# Altium schematic sheet adc_dac_main.SchDoc: mcHF Pro Transceiver UI board
size A3; Author: Krassi Atanassov; CompanyName: MØNKA; Engineer: For radio amateurs experimentation, non-commercial use only. Thank you!; Revision: 0.8.2; SheetTotal: 18
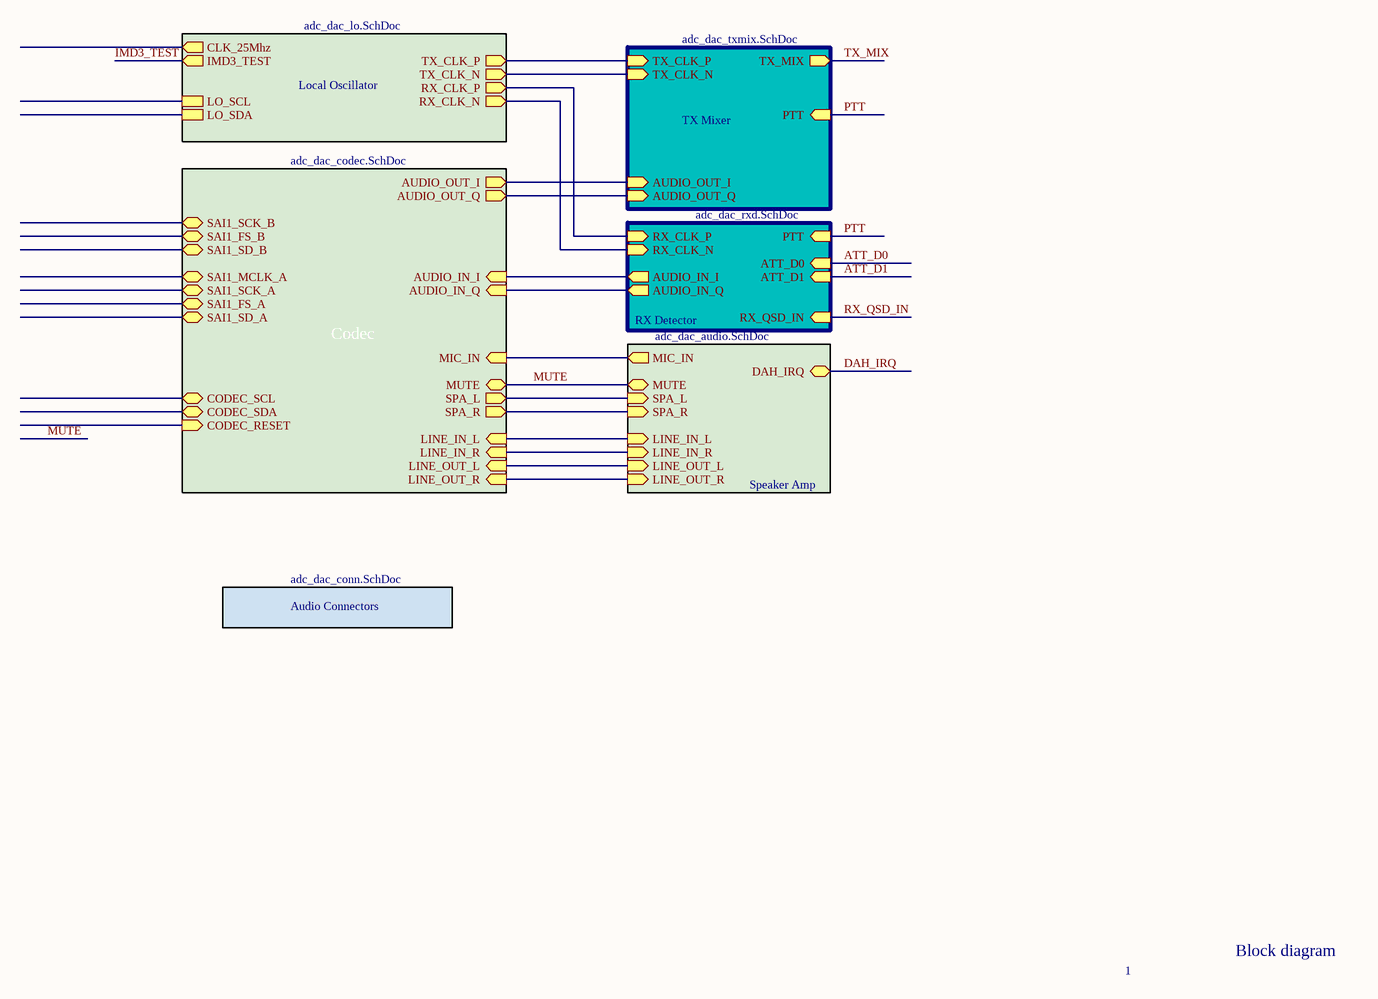
[diagram p0: adc_dac_main.SchDoc]

## Sub-sheets
Audio Connectors = adc_dac_conn.SchDoc: no entries
Codec = adc_dac_codec.SchDoc: CODEC_SCL (bidir), CODEC_RESET (in), CODEC_SDA (bidir), AUDIO_OUT_I (out), AUDIO_OUT_Q (out), AUDIO_IN_I (in), AUDIO_IN_Q (in), MIC_IN (in), SPA_L (out), MUTE (bidir), LINE_IN_L (in), LINE_IN_R (in), LINE_OUT_L (in), LINE_OUT_R (in), SPA_R (out), SAI1_SCK_B (bidir), SAI1_FS_B (bidir), SAI1_SD_B (bidir), SAI1_MCLK_A (bidir), SAI1_SCK_A (bidir), SAI1_FS_A (bidir), SAI1_SD_A (bidir)
Local Oscillator = adc_dac_lo.SchDoc: LO_SCL, LO_SDA, RX_CLK_N (out), RX_CLK_P (out), TX_CLK_P (out), TX_CLK_N (out), CLK_25Mhz (out), IMD3_TEST (out)
RX Detector = adc_dac_rxd.SchDoc: RX_QSD_IN (in), AUDIO_IN_I (out), AUDIO_IN_Q (out), PTT (in), RX_CLK_N (in), RX_CLK_P (in), ATT_D0 (in), ATT_D1 (in)
Speaker Amp = adc_dac_audio.SchDoc: DAH_IRQ (bidir), MIC_IN (out), SPA_L (in), MUTE (bidir), LINE_IN_L (in), LINE_IN_R (in), LINE_OUT_L (in), LINE_OUT_R (in), SPA_R (in)
TX Mixer = adc_dac_txmix.SchDoc: TX_MIX (out), TX_CLK_P (in), TX_CLK_N (in), AUDIO_OUT_I (in), AUDIO_OUT_Q (in), PTT (in)

## Nets
ATT_D0: sheet RX Detector/ATT_D0
ATT_D1: sheet RX Detector/ATT_D1
DAH_IRQ: sheet Speaker Amp/DAH_IRQ
IMD3_TEST: sheet Local Oscillator/IMD3_TEST
MUTE: sheet Speaker Amp/MUTE, sheet Codec/MUTE
PTT: sheet TX Mixer/PTT, sheet RX Detector/PTT
RX_QSD_IN: sheet RX Detector/RX_QSD_IN
TX_MIX: sheet TX Mixer/TX_MIX
(unnamed): sheet Local Oscillator/RX_CLK_N, sheet RX Detector/RX_CLK_N
(unnamed): sheet Local Oscillator/RX_CLK_P, sheet RX Detector/RX_CLK_P
(unnamed): sheet Local Oscillator/TX_CLK_P, sheet TX Mixer/TX_CLK_P
(unnamed): sheet Local Oscillator/TX_CLK_N, sheet TX Mixer/TX_CLK_N
(unnamed): sheet Speaker Amp/MIC_IN, sheet Codec/MIC_IN
(unnamed): sheet Speaker Amp/SPA_L, sheet Codec/SPA_L
(unnamed): sheet Speaker Amp/LINE_IN_L, sheet Codec/LINE_IN_L
(unnamed): sheet Speaker Amp/LINE_IN_R, sheet Codec/LINE_IN_R
(unnamed): sheet Speaker Amp/LINE_OUT_L, sheet Codec/LINE_OUT_L
(unnamed): sheet Speaker Amp/LINE_OUT_R, sheet Codec/LINE_OUT_R
(unnamed): sheet Speaker Amp/SPA_R, sheet Codec/SPA_R
(unnamed): sheet TX Mixer/AUDIO_OUT_I, sheet Codec/AUDIO_OUT_I
(unnamed): sheet TX Mixer/AUDIO_OUT_Q, sheet Codec/AUDIO_OUT_Q
(unnamed): sheet RX Detector/AUDIO_IN_I, sheet Codec/AUDIO_IN_I
(unnamed): sheet RX Detector/AUDIO_IN_Q, sheet Codec/AUDIO_IN_Q

## Notes on the sheet
- 1
- Block diagram
- Date:
- File:
- Revision:
- Sheet
- of
- License: